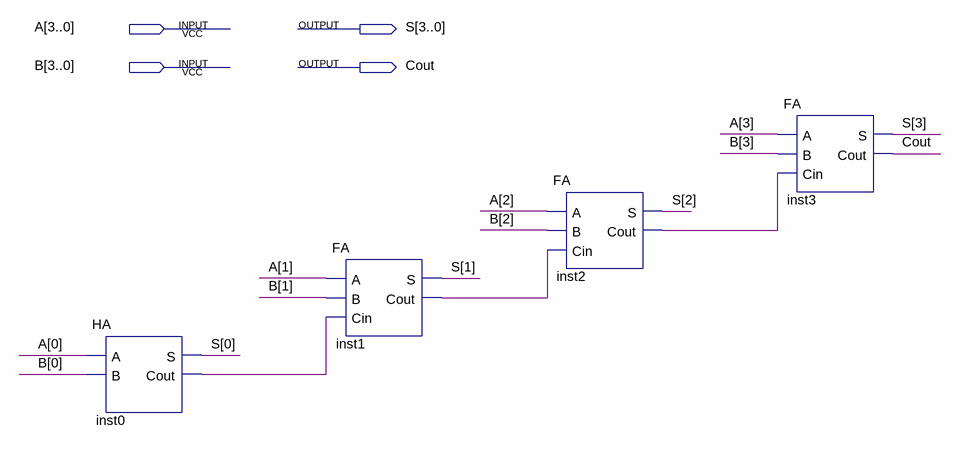
[diagram p0: schematic sheet]
// Quartus schematic Lab01.bdf as structural Verilog: 4 symbols, 4 pins
module Lab01 (
  input  [3:0] A,
  input  [3:0] B,
  output [3:0] S,
  output Cout
);

  wire inst0_cout, inst1_cout, inst2_cout;

  HA inst0 (.A(A[0]), .B(B[0]), .S(S[0]), .Cout(inst0_cout));
  FA inst1 (.A(A[1]), .B(B[1]), .Cin(inst0_cout), .S(S[1]), .Cout(inst1_cout));
  FA inst2 (.A(A[2]), .B(B[2]), .Cin(inst1_cout), .S(S[2]), .Cout(inst2_cout));
  FA inst3 (.A(A[3]), .B(B[3]), .Cin(inst2_cout), .S(S[3]), .Cout(Cout));
endmodule
